# EAGLE schematic ESP-Live (EAGLE 7.7.0)
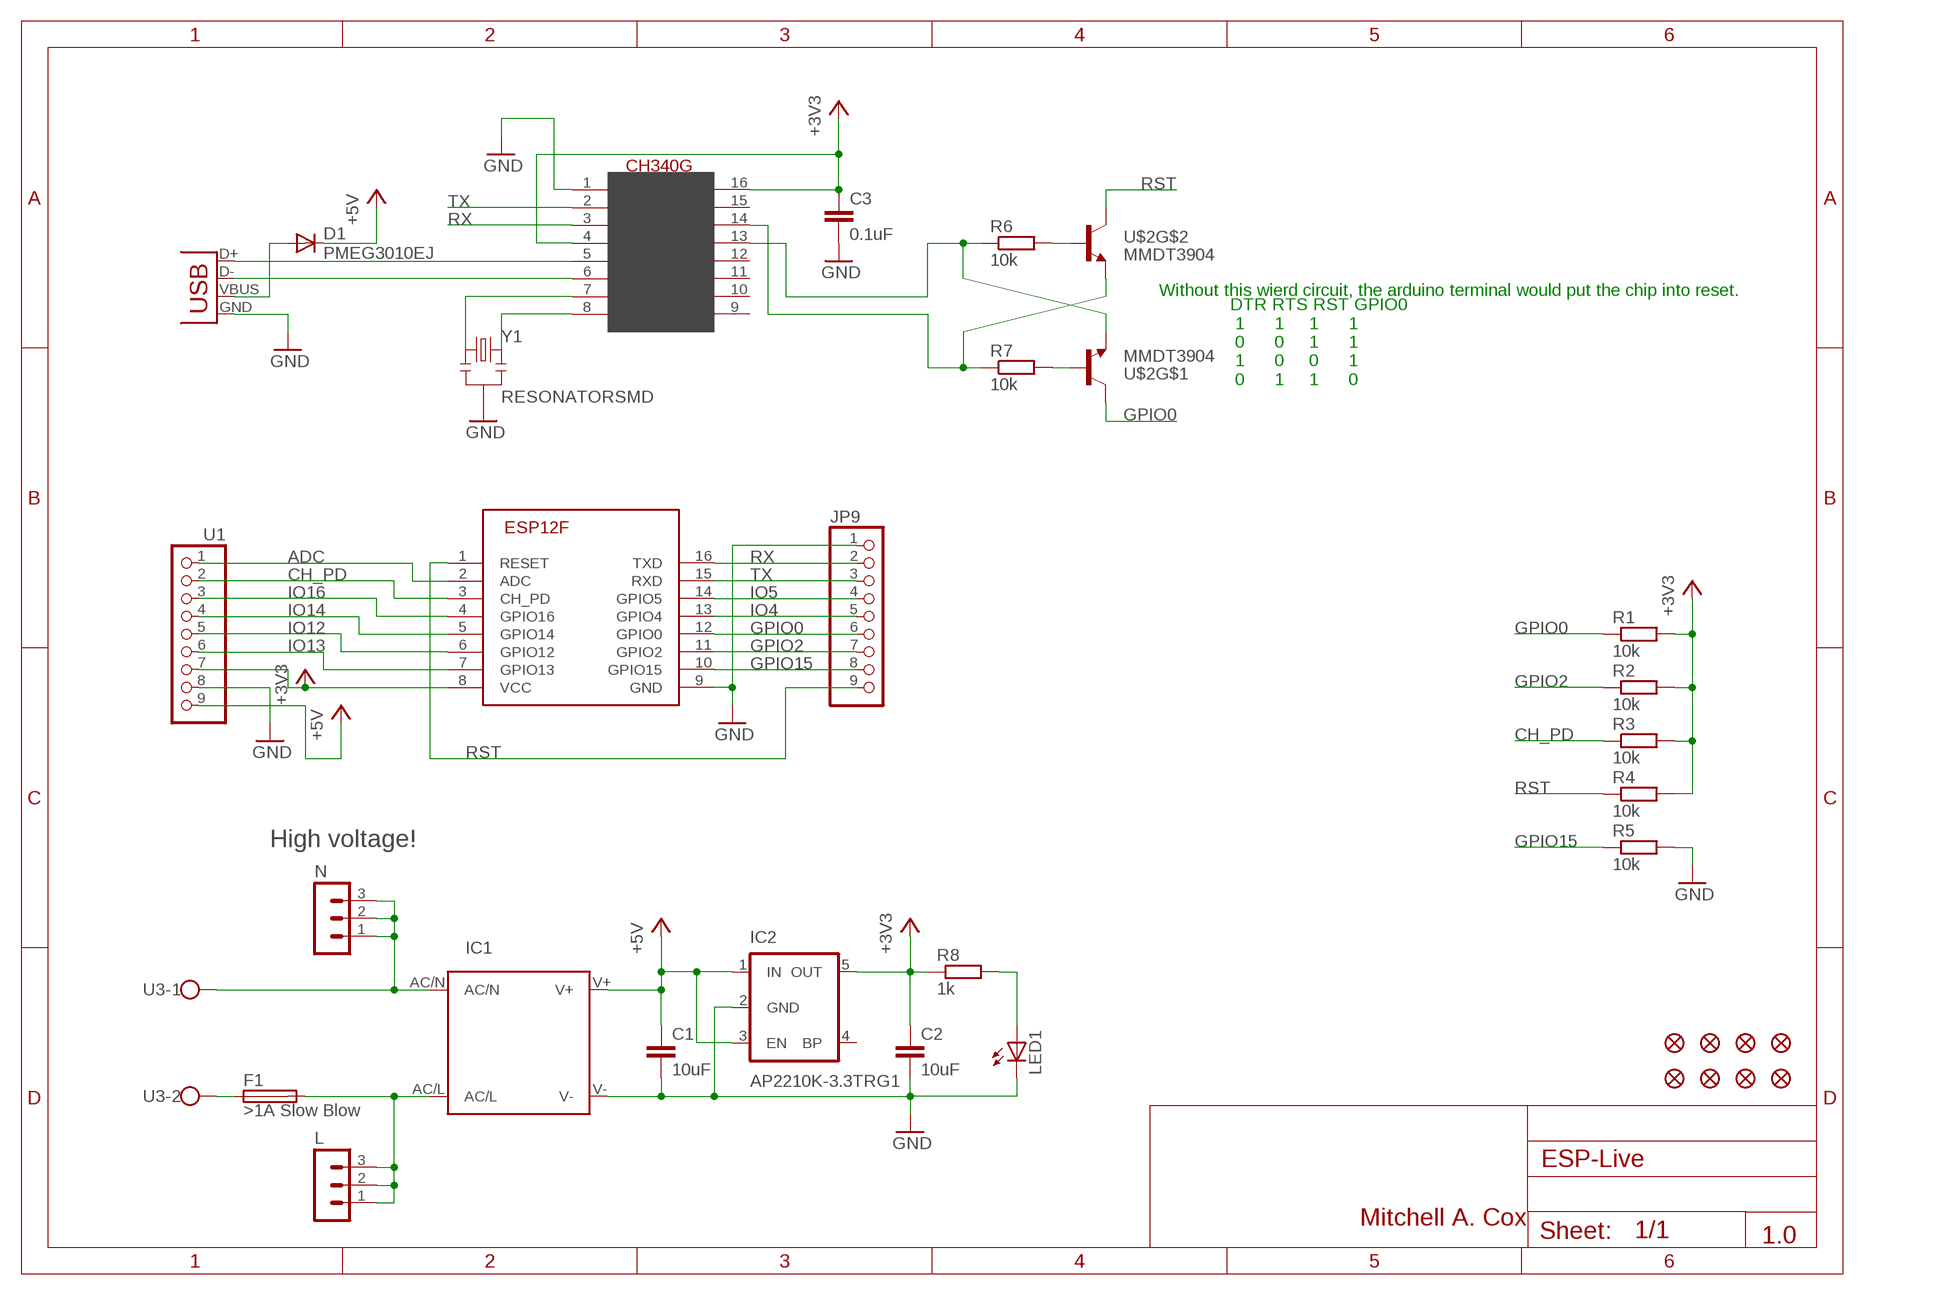
[diagram p0: schematic, sheet 1]

## Parts
C1  10uF  C-EUC0805  [C0805]
C2  10uF  C-EUC0805  [C0805]
C3  0.1uF  C-EUC0805  [C0805]
CN1  USBSMD  [USB-MINIB]
D1  PMEG3010EJ  DIODESOD  [SOD-323]
F1  >1A Slow Blow  TE5  [TE5]
IC1  IRM_01/02_SMDIRM_01/02_SMD  [IRM_01/02_SMD]
IC2  AP2210K-3.3TRG1  V_REG_LDOSMD  [SOT23-5]
IC3  ESP-12F  [ESP-12F]
JP1  FIDUCIAL1X2  [FIDUCIAL-1X2]
JP2  FIDUCIAL1X2  [FIDUCIAL-1X2]
JP3  FIDUCIAL1X2  [FIDUCIAL-1X2]
JP4  FIDUCIAL1X2  [FIDUCIAL-1X2]
JP5  FIDUCIAL1X2  [FIDUCIAL-1X2]
JP6  FIDUCIAL1X2  [FIDUCIAL-1X2]
JP7  FIDUCIAL1X2  [FIDUCIAL-1X2]
JP8  FIDUCIAL1X2  [FIDUCIAL-1X2]
JP9  PINHD-1X9  [1X09-BIG]
L  MA03-1  [MA03-1]
LED1  LEDCHIPLED_0805  [CHIPLED_0805]
N  MA03-1  [MA03-1]
R1  10k  R-EU_M0805  [M0805]
R2  10k  R-EU_M0805  [M0805]
R3  10k  R-EU_M0805  [M0805]
R4  10k  R-EU_M0805  [M0805]
R5  10k  R-EU_M0805  [M0805]
R6  10k  R-EU_M0805  [M0805]
R7  10k  R-EU_M0805  [M0805]
R8  1k  R-EU_M0805  [M0805]
U1  PINHD-1X9  [1X09-BIG]
U3  W237-113  [W237-113]
U$1  CH340G  [SOIC16]
U$2  MMDT3904  [SOT363]
Y1  RESONATORSMD  [RESONATOR-SMD]

## Nets
+3V3: C2.1 C3.1 IC2.5(OUT) IC3.8(VCC) R1.2 R2.2 R3.2 R4.2 R8.1 U1.7 U$1.4(V3) U$1.16(VCC)
+5V: C1.1 D1.1(C) IC1.V+ IC2.1(IN) IC2.3(EN) U1.9
ADC: IC3.2(ADC) U1.1
CH_PD: IC3.3(CH_PD) R3.1 U1.2
GND: C1.2 C2.2 C3.2 CN1.GND IC1.V- IC2.2(GND) IC3.9(GND) JP9.1 LED1.C R5.2 U1.8 U$1.1(GND) Y1.2
GPIO0: IC3.12(GPIO0) JP9.6 R1.1 U$2.3(C)
GPIO2: IC3.11(GPIO2) JP9.7 R2.1
GPIO15: IC3.10(GPIO15) JP9.8 R5.1
IO4: IC3.13(GPIO4) JP9.5
IO5: IC3.14(GPIO5) JP9.4
IO12: IC3.6(GPIO12) U1.5
IO13: IC3.7(GPIO13) U1.6
IO14: IC3.5(GPIO14) U1.4
IO16: IC3.4(GPIO16) U1.3
N$1: F1.1 U3.2
N$2: IC1.AC/N N.1 N.2 N.3 U3.1
N$3: F1.2 IC1.AC/L L.1 L.2 L.3
N$4: LED1.A R8.2
N$8: R7.2 U$2.5(B)
N$10: R6.2 U$2.2(B)
N$11: R6.1 U$1.13(DTR) U$2.4(E)
N$12: CN1.D+ U$1.5(D+)
N$15: R7.1 U$1.14(RTS) U$2.1(E)
N$16: CN1.D- U$1.6(D-)
N$17: CN1.VBUS D1.2(A)
N$21: U$1.7(XI) Y1.1
N$22: U$1.8(XO) Y1.3
RST: IC3.1(RESET) JP9.9 R4.1 U$2.6(C)
RX: IC3.16(TXD) JP9.2 U$1.3(RX)
TX: IC3.15(RXD) JP9.3 U$1.2(TX)
Unconnected: IC2.4(BP) U$1.9(CTS) U$1.10(DSR) U$1.11(RI) U$1.12(DCD) U$1.15(RS232)

## Notes on the sheet
- Without this wierd circuit, the arduino terminal would put the chip into reset.
- DTR RTS RST GPIO0
   1      1     1      1
   0      0     1      1
   1      0     0      1
   0      1     1      0
- High voltage!
- Mitchell A. Cox
- 1.0

## Library data of the parts
C1-C3 = rcl:C-EU: CAPACITOR, European symbol
CN1 = SparkFun:USB: USB Connectors USB-B-PTH is fully proven SKU : PRT-00139 USB-miniB is fully proven SKU : PRT-00587 USB-A-PCB is untested. USB-A-H is throughly reviewed, but untested. Spark Fun Electronics SKU : PRT-00437 USB-B-SMT is throughly reviewed, but untested. Needs silkscreen touching up. USB-A-S has not been used/tested USB-MB-H has not been used/tested
D1 = SparkFun:DIODE: Diode These are standard reverse protection diodes and small signal diodes. SMA package can handle up to about 1A. SOD-323 can handle about 200mA. What the SOD-323 package when ordering, there are some mfgs out there that are 5-pin packages.
F1 = fuse:TE5: FUSE Wickmann; OC_FARNELL: unknown; OC_NEWARK: unknown
IC1 = meanwell_irm_v7:IRM_01/02_SMD: 1 or 2 watt housing & pin compatible IRM 01 Vout [V] Imax [A] Pmax [W] Eff [%] 3.3 0.3 1 66 5 0.2 1 70 9 0.111 1 72 12 0.083 1 74 15 0.067 1 75 24 0.042 1 77 IRM 2 Vout [V] Imax [A] Pmax [W] Eff [%] 3.3 0.6 2 66 5 0.4 2 70 9 0.222 2 72 12 0.167 2 74 15 0.133 2 75 24 0.087 2 77
IC2 = SparkFun:V_REG_LDO: Voltage Regulator LDO Standard 150mA LDO voltage regulator in SOT-23 layout. Micrel part MIC5205. BP (by-pass) pin is used to lower output noise with 470pF cap.
IC3 = adafruit:ESP-12F
JP1-JP8 = SparkFun:FIDUCIAL: Fiducial Alignment Points Various fiducial points for machine vision alignment.
JP9 U1 = adafruit:PINHD-1X9: Pin header 1x10 0.1" spacing With round pins
L N = con-lstb:MA03-1: PIN HEADER; OC_FARNELL: unknown; OC_NEWARK: unknown
LED1 = adafruit:LED: LED OSRAM: - CHIPLED LG R971, LG N971, LY N971, LG Q971, LY Q971, LO R971, LY R971 LH N974, LH R974 LS Q976, LO Q976, LY Q976 LO Q996 - Hyper CHIPLED LW Q18S LB Q993, LB Q99A, LB R99A - SideLED LS A670, LO A670, LY A670, LG A670, LP A670 LB A673, LV A673, LT A673, LW A673 LH A674 LY A675 LS A676, LA A676, LO A676, LY A676, LW A676 LS A679, LY A679, LG A679 - Hyper Micro SIDELED® LS Y876, LA Y876, LO Y876, LY Y876 LT Y87S - SmartLED LW L88C, LW L88S LB L89C, LB L89S, LG L890 LS L89K, LO L89K, LY L89K LS L896, LA L896, LO L896, LY L896 - TOPLED LS T670, LO T670, LY T670, LG T670, LP T670 LSG T670, LSP T670, LSY T670, LOP T670, LYG T670 LG T671, LOG T671, LSG T671 LB T673, LV T673, LT T673, LW T673 LH T674 LS T676, LA T676, LO T676, LY T676, LB T676, LH T676, LSB T676, LW T676 LB T67C, LV T67C, LT T67C, LS T67K, LO T67K, LY T67K, LW E67C LS E67B, LA E67B, LO E67B, LY E67B, LB E67C, LV E67C, LT E67C LW T67C LS T679, LY T679, LG T679 LS T770, LO T770, LY T770, LG T770, LP T770 LB T773, LV T773, LT T773, LW T773 LH T774 LS E675, LA E675, LY E675, LS T675 LS T776, LA T776, LO T776, LY T776, LB T776 LHGB T686 LT T68C, LB T68C - Hyper Mini TOPLED® LB M676 - Mini TOPLED Santana® LG M470 LS M47K, LO M47K, LY M47K Source: http://www.osram.convergy.de/
R1-R8 = rcl:R-EU_: RESISTOR, European symbol
U3 = con-wago-500:W237-113: WAGO SCREW CLAMP; OC_FARNELL: unknown; OC_NEWARK: unknown
U$1 = usb-serial:CH340G
U$2 = SparkFun:MMDT3904
Y1 = SparkFun:RESONATOR: Resonator Small SMD resonator. This is the itty bitty 10/20MHz resonators with built in caps. CSTCE10M0G55 and CSTCE20M0V53. Footprint has been reviewed closely but hasn't been tested yet.